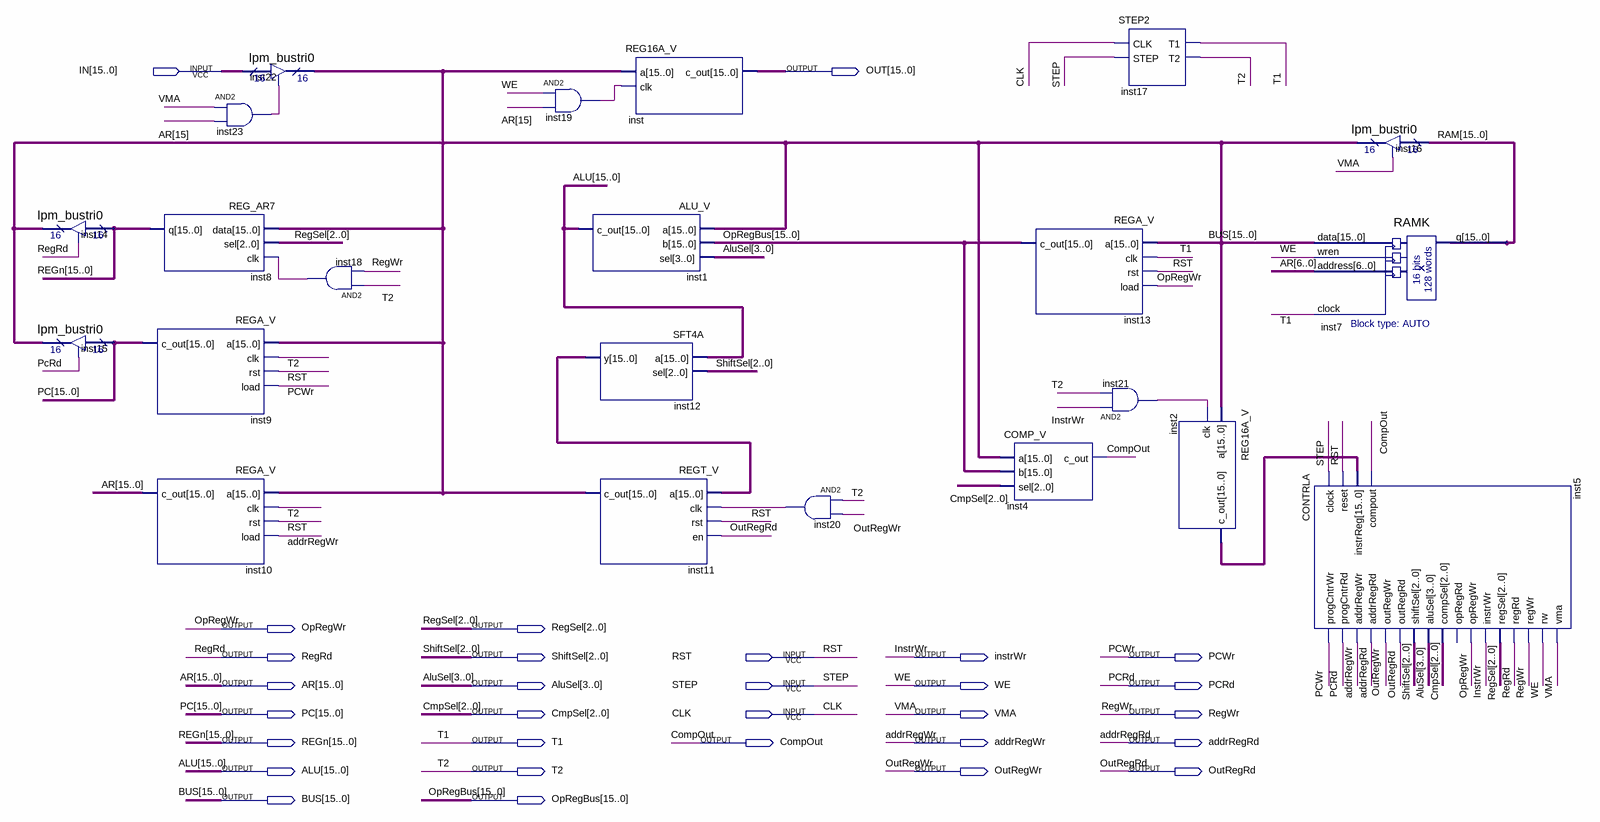
[diagram p0: schematic sheet]
// Quartus schematic kx9016.bdf as structural Verilog: 22 symbols, 30 pins
module kx9016 (
  input  [15:0] IN,
  input  RST,
  input  STEP,
  input  CLK,
  output [15:0] OUT,
  output OpRegWr,
  output [2:0] RegSel,
  output RegRd,
  output [2:0] ShiftSel,
  output instrWr,
  output PCWr,
  output [15:0] AR,
  output [3:0] AluSel,
  output WE,
  output PCRd,
  output [15:0] PC,
  output [2:0] CmpSel,
  output VMA,
  output RegWr,
  output [15:0] REGn,
  output T1,
  output CompOut,
  output addrRegWr,
  output addrRegRd,
  output [15:0] ALU,
  output T2,
  output OutRegWr,
  output OutRegRd,
  output [15:0] BUS,
  output [15:0] OpRegBus
);

  wire inst18_out, inst19_out, inst20_out, inst21_out, inst23_out;
  wire [15:0] inst2_c_out, inst12_y, RAM;

  lpm_bustri0 inst14 (.enabledt(RegRd), .data(REGn), .tridata(BUS));
  lpm_bustri0 inst15 (.enabledt(PCRd), .data(PC), .tridata(BUS));
  REG_AR7 inst8 (.data(BUS), .sel(RegSel), .clk(inst18_out), .q(REGn));
  REGA_V inst9 (.a(BUS), .clk(T2), .rst(RST), .load(PCWr), .c_out(PC));
  REGA_V inst10 (.a(BUS), .clk(T2), .rst(RST), .load(addrRegWr), .c_out(AR));
  lpm_bustri0 inst22 (.enabledt(inst23_out), .data(IN), .tridata(BUS));
  and inst23 (inst23_out, VMA, AR[15]);
  and inst18 (inst18_out, T2, RegWr);
  and inst19 (inst19_out, WE, AR[15]);
  ALU_V inst1 (.a(BUS), .b(OpRegBus), .sel(AluSel), .c_out(ALU));
  SFT4A inst12 (.a(ALU), .sel(ShiftSel), .y(inst12_y));
  REGT_V inst11 (.a(inst12_y), .clk(inst20_out), .rst(RST), .en(OutRegRd), .c_out(BUS));
  REG16A_V inst (.a(BUS), .clk(inst19_out), .c_out(OUT));
  and inst20 (inst20_out, T2, OutRegWr);
  COMP_V inst4 (.a(BUS), .b(OpRegBus), .sel(CmpSel), .c_out(CompOut));
  REGA_V inst13 (.a(BUS), .clk(T1), .rst(RST), .load(OpRegWr), .c_out(OpRegBus));
  STEP2 inst17 (.CLK(CLK), .STEP(STEP), .T1(T1), .T2(T2));
  and inst21 (inst21_out, instrWr, T2);
  REG16A_V inst2 (.a(BUS), .clk(inst21_out), .c_out(inst2_c_out));
  RAMK inst7 (.data(BUS), .wren(WE), .address(AR[6:0]), .clock(T1), .q(RAM));
  CONTRLA inst5 (
    .clock(STEP), .reset(RST), .instrReg(inst2_c_out), .compout(CompOut), .progCntrWr(PCWr),
    .progCntrRd(PCRd), .addrRegWr(addrRegWr), .addrRegRd(addrRegRd), .outRegWr(OutRegWr),
    .outRegRd(OutRegRd), .shiftSel(ShiftSel), .aluSel(AluSel), .compSel(CmpSel), .opRegWr(OpRegWr),
    .instrWr(instrWr), .regSel(RegSel), .regRd(RegRd), .regWr(RegWr), .rw(WE), .vma(VMA));  // open: opRegRd
  lpm_bustri0 inst16 (.enabledt(VMA), .data(RAM), .tridata(BUS));
endmodule
